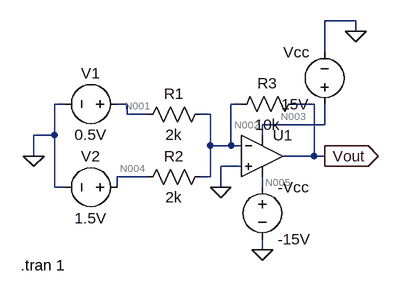
[diagram p0: schematic Draft5.asc]
Draft5.asc, the LTspice schematic file:
Version 4
SHEET 1 880 680
WIRE 352 -80 304 -80
WIRE 352 -64 352 -80
WIRE 304 -32 304 -80
WIRE -96 48 -112 48
WIRE 0 48 -16 48
WIRE 176 48 160 48
WIRE 288 48 256 48
WIRE 0 64 0 48
WIRE 32 64 0 64
WIRE 128 64 112 64
WIRE 304 80 304 48
WIRE 304 80 208 80
WIRE -112 96 -112 48
WIRE -112 96 -144 96
WIRE 208 96 208 80
WIRE 128 112 128 64
WIRE 160 112 160 48
WIRE 160 112 128 112
WIRE 176 112 160 112
WIRE -144 128 -144 96
WIRE 288 128 288 48
WIRE 288 128 240 128
WIRE 304 128 288 128
WIRE 176 144 144 144
WIRE 32 160 -16 160
WIRE 128 160 128 112
WIRE 128 160 112 160
WIRE -112 176 -112 96
WIRE -96 176 -112 176
WIRE -16 176 -16 160
WIRE 144 176 144 144
WIRE 208 176 208 160
WIRE 208 272 208 256
FLAG 208 272 0
FLAG 144 176 0
FLAG 304 128 Vout
IOPIN 304 128 Out
FLAG 352 -64 0
FLAG -144 128 0
SYMBOL Opamps\\UniversalOpamp2 208 128 R0
SYMATTR InstName U1
SYMBOL res 128 48 R90
WINDOW 0 0 56 VBottom 2
WINDOW 3 32 56 VTop 2
SYMATTR InstName R1
SYMATTR Value 2k
SYMBOL res 128 144 R90
WINDOW 0 0 56 VBottom 2
WINDOW 3 32 56 VTop 2
SYMATTR InstName R2
SYMATTR Value 2k
SYMBOL res 272 32 R90
WINDOW 0 0 56 VBottom 2
WINDOW 3 32 56 VTop 2
SYMATTR InstName R3
SYMATTR Value 10k
SYMBOL voltage 208 160 R0
SYMATTR InstName -Vcc
SYMATTR Value -15V
SYMBOL voltage 0 48 R90
WINDOW 0 -32 56 VBottom 2
WINDOW 3 32 56 VTop 2
SYMATTR InstName V1
SYMATTR Value 0.5V
SYMBOL voltage 0 176 R90
WINDOW 0 -32 56 VBottom 2
WINDOW 3 32 56 VTop 2
SYMATTR InstName V2
SYMATTR Value 1.5V
SYMBOL voltage 304 64 R180
WINDOW 0 24 96 Left 2
WINDOW 3 24 16 Left 2
SYMATTR InstName Vcc
SYMATTR Value 15V
TEXT -164 296 Left 2 !.tran 1

The netlist it stands for:
* Draft5.asc
XU1 0 N002 N003 N005 Vout level.2 Avol=1Meg GBW=10Meg Slew=10Meg ilimit=25m rail=0 Vos=0 phimargin=45 en=0 enk=0 in=0 ink=0 Rin=500Meg  ; pins IN+ IN- V+ V- OUT
R1 N002 N001 2k
R2 N002 N004 2k
R3 Vout N002 10k
V§-Vcc N005 0 -15V
V1 N001 0 0.5V
V2 N004 0 1.5V
Vcc N003 0 15V
.tran 1
.lib UniversalOpamps2.sub
.backanno
.end

* Results of the author's LTspice run, read from the files saved beside the schematic
* Operating Point, zero values left out:
*   V(vout) = -10 V
*   V(n003) = 15 V
*   V(n005) = -15 V
*   V(n002) = 10.03 µV
*   V(n001) = 500 mV
*   V(n004) = 1.5 V
*   I(R3) = -1 mA
*   I(R2) = -750 µA
*   I(R1) = -250 µA
*   I(Vcc) = -724 µA
*   I(V2) = -750 µA
*   I(V1) = -250 µA
*   I(-vcc) = 1.724 mA
*   Ix(u1:3) = 724 µA
*   Ix(u1:4) = -1.724 mA
*   Ix(u1:5) = 1 mA